# Altium schematic sheet 06 - External ADC.SchDoc
size A4
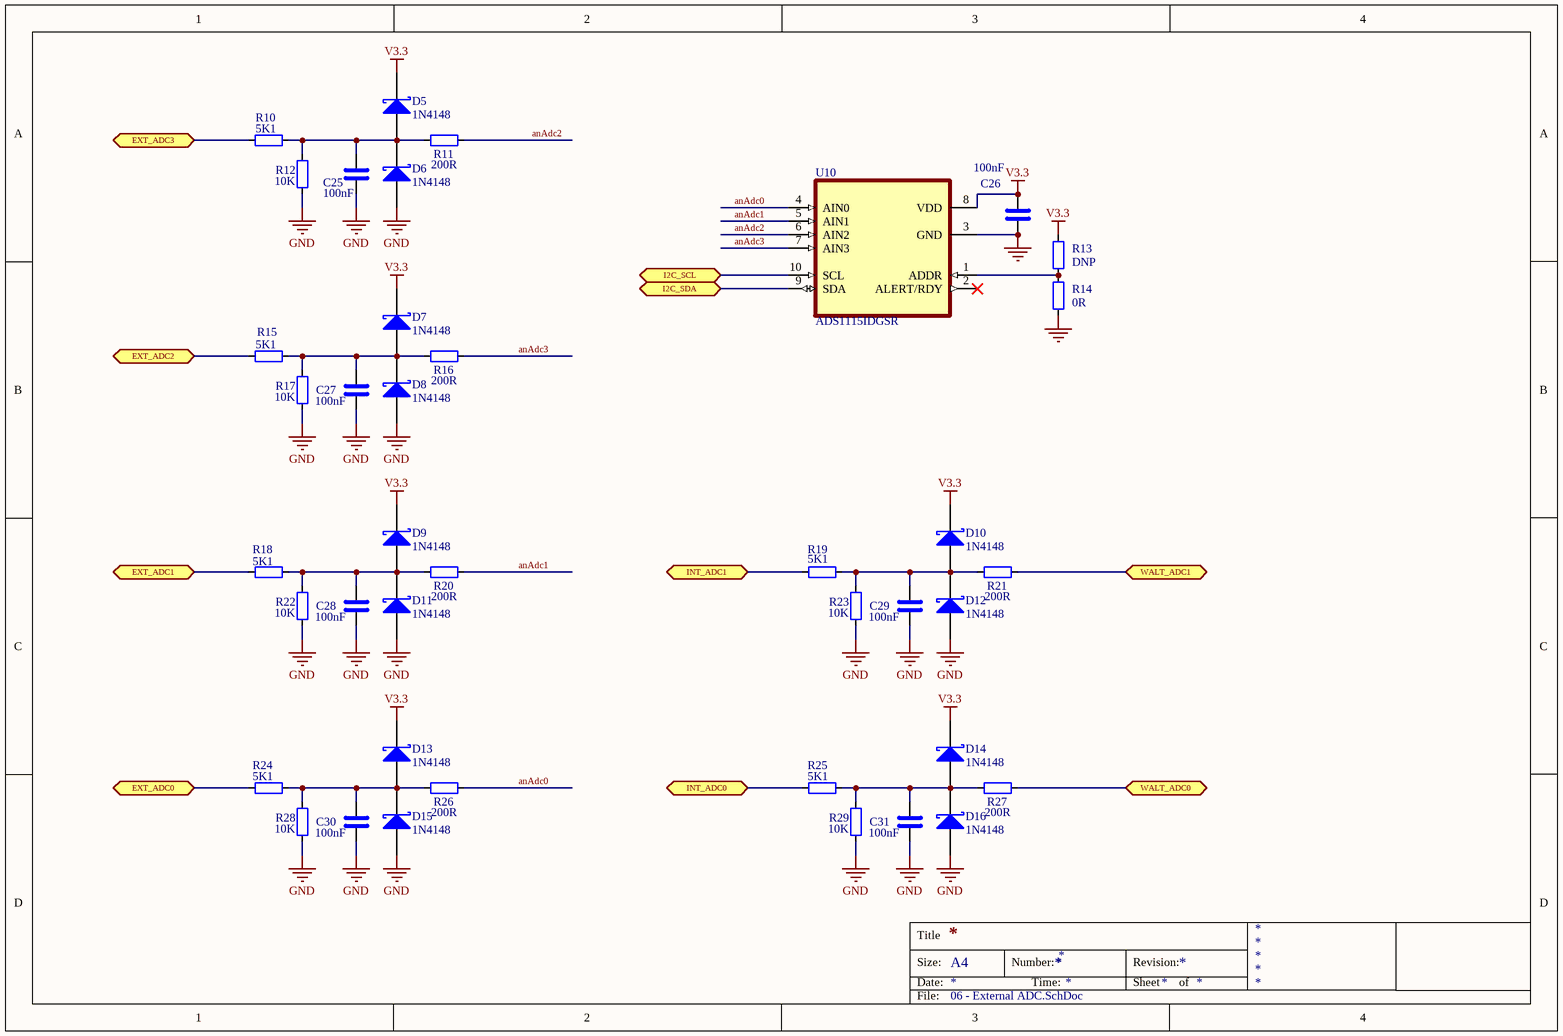
[diagram p0: 06 - External ADC.SchDoc]

## Parts
C25  100nF  [CAP_0603]
C26  100nF  [CAP_0603]
C27  100nF  [CAP_0603]
C28  100nF  [CAP_0603]
C29  100nF  [CAP_0603]
C30  100nF  [CAP_0603]
C31  100nF  [CAP_0603]
D5  1N4148  [SOD323_STM_NW]
D6  1N4148  [SOD323_STM_NW]
D7  1N4148  [SOD323_STM_NW]
D8  1N4148  [SOD323_STM_NW]
D9  1N4148  [SOD323_STM_NW]
D10  1N4148  [SOD323_STM_NW]
D11  1N4148  [SOD323_STM_NW]
D12  1N4148  [SOD323_STM_NW]
D13  1N4148  [SOD323_STM_NW]
D14  1N4148  [SOD323_STM_NW]
D15  1N4148  [SOD323_STM_NW]
D16  1N4148  [SOD323_STM_NW]
R10  value 5K1  [RES_0603]  (hidden comment: 5K1 1%)
R11  value 200R  [RES_0603]  (hidden comment: 200R %5)
R12  value 10K  [RES_0603]  (hidden comment: 10K 1%)
R13  DNP  [RES_0603]
R14  0R  [RES_0603]
R15  value 5K1  [RES_0603]  (hidden comment: 5K1 1%)
R16  value 200R  [RES_0603]  (hidden comment: 200R %5)
R17  value 10K  [RES_0603]  (hidden comment: 10K 1%)
R18  value 5K1  [RES_0603]  (hidden comment: 5K1 1%)
R19  value 5K1  [RES_0603]  (hidden comment: 5K1 1%)
R20  value 200R  [RES_0603]  (hidden comment: 200R %5)
R21  value 200R  [RES_0603]  (hidden comment: 200R %5)
R22  value 10K  [RES_0603]  (hidden comment: 10K 1%)
R23  value 10K  [RES_0603]  (hidden comment: 10K 1%)
R24  value 5K1  [RES_0603]  (hidden comment: 5K1 1%)
R25  value 5K1  [RES_0603]  (hidden comment: 5K1 1%)
R26  value 200R  [RES_0603]  (hidden comment: 200R %5)
R27  value 200R  [RES_0603]  (hidden comment: 200R %5)
R28  value 10K  [RES_0603]  (hidden comment: 10K 1%)
R29  value 10K  [RES_0603]  (hidden comment: 10K 1%)
U10  ADS1115IDGSR  [SOP50P490X110-10N]

## Ports
EXT_ADC0 (bidir), EXT_ADC1 (bidir), EXT_ADC2 (bidir), EXT_ADC3 (bidir), I2C_SCL (bidir), I2C_SDA (bidir), INT_ADC0 (bidir), INT_ADC1 (bidir), WALT_ADC0 (bidir), WALT_ADC1 (bidir)

## Nets
GND: C25.2 C26.2 C27.2 C28.2 C29.2 C30.2 C31.2 D6.2(A) D8.2(A) D11.2(A) D12.2(A) D15.2(A) D16.2(A) R12.1 R14.2 R17.1 R22.1 R23.1 R28.1 R29.1 U10.3(GND)
V3.3: C26.1 D5.1(K) D7.1(K) D9.1(K) D10.1(K) D13.1(K) D14.1(K) R13.1 U10.8(VDD)
anAdc0: R26.2 U10.4(AIN0)
anAdc1: R20.2 U10.5(AIN1)
anAdc2: R11.2 U10.6(AIN2)
anAdc3: R16.2 U10.7(AIN3)
EXT_ADC0: R24.1 ; port EXT_ADC0
EXT_ADC1: R18.1 ; port EXT_ADC1
EXT_ADC2: R15.1 ; port EXT_ADC2
EXT_ADC3: R10.1 ; port EXT_ADC3
I2C_SCL: U10.10(SCL) ; port I2C_SCL
I2C_SDA: U10.9(SDA) ; port I2C_SDA
INT_ADC0: R25.1 ; port INT_ADC0
INT_ADC1: R19.1 ; port INT_ADC1
WALT_ADC0: R27.2 ; port WALT_ADC0
WALT_ADC1: R21.2 ; port WALT_ADC1
NetC25_1: C25.1 D5.2(A) D6.1(K) R10.2 R11.1 R12.2
NetC27_1: C27.1 D7.2(A) D8.1(K) R15.2 R16.1 R17.2
NetC28_1: C28.1 D9.2(A) D11.1(K) R18.2 R20.1 R22.2
NetC29_1: C29.1 D10.2(A) D12.1(K) R19.2 R21.1 R23.2
NetC30_1: C30.1 D13.2(A) D15.1(K) R24.2 R26.1 R28.2
NetC31_1: C31.1 D14.2(A) D16.1(K) R25.2 R27.1 R29.2
NetR13_2: R13.2 R14.1 U10.1(ADDR)

Not connected (* = marked no-connect by the designer): U10 2(ALERT/RDY)*

## Notes on the sheet
- Title
- Size:
- Date:
- A4
- Number:
- Time:
- Revision:
- Sheet
- of
- File:

## Library data of the parts
C25-C31 = C: pdf: https://www.lcsc.com/datasheet/lcsc_datasheet_2501031500_HRE-CGA0603X7R104K500JT_C6119867.pdf; LCSC PART: C6119867; lcsc link: https://www.lcsc.com/product-detail/Multilayer-Ceramic-Capacitors-MLCC-SMD-SMT_HRE-CGA0603X7R104K500JT_C6119867.html?s_z=n_100nF; JLCPCB: C6119867; Value: 100nF
D5-D16 = 1N4148_KA: LCSC PART: C84063; JLCPCB: C84063; lcsc link: https://www.lcsc.com/product-detail/Switching-Diodes_Changzhou-Starsea-Elec-1N4148WS_C84063.html?s_z=n_1n4148; pdf: https://www.lcsc.com/datasheet/lcsc_datasheet_1811021610_Changzhou-Starsea-Elec-1N4148WS_C84063.pdf; Value: 1N4148
R10-R29 = R
  R10 R15 R18 R19 R24 R25: JLCPCB: C23186; LCSC PART: C23186; lcsc link: https://www.lcsc.com/product-detail/Chip-Resistor-Surface-Mount_UNI-ROYAL-Uniroyal-Elec-0603WAF5101T5E_C23186.html
  R11 R16 R20 R21 R26 R27: JLCPCB: C2907123; LCSC PART: C2907123; lcsc link: https://www.lcsc.com/product-detail/Chip-Resistor-Surface-Mount_FOJAN-FRC0603J201-TS_C2907123.html
  R12 R17 R22 R23 R28 R29: JLCPCB: C25804; LCSC PART: C25804; lcsc link: https://www.lcsc.com/product-detail/Chip-Resistor-Surface-Mount_UNI-ROYAL-Uniroyal-Elec-0603WAF1002T5E_C25804.html
  R13: Value: DNP
  R14: Value: 0R; JLCPCB: C15402; LCSC PART: C15402; lcsc link: https://www.lcsc.com/product-detail/Chip-Resistor-Surface-Mount_UNI-ROYAL-Uniroyal-Elec-0603WAJ0000T5E_C15402.html
U10 = ADS1015IDGSR: 12-Bit, 3.3kSPS, 4-Ch Delta-Sigma ADC With PGA, Oscillator, VREF, Comparator and I2C Interface 10-VSSOP -40 to 125; Value: ADS1115IDGSR; LCSC PART: C37593; JLCPCB: C37593; lcsc link: https://www.lcsc.com/product-detail/Analog-to-Digital-Converters-ADC_Texas-Instruments-ADS1115IDGSR_C37593.html?s_z=n_ADS1115IDGSR; pdf: https://www.lcsc.com/datasheet/lcsc_datasheet_1809192322_Texas-Instruments-ADS1115IDGSR_C37593.pdf